# EAGLE design Girlfriend Tracker V0.1 (EAGLE 8.5.0)
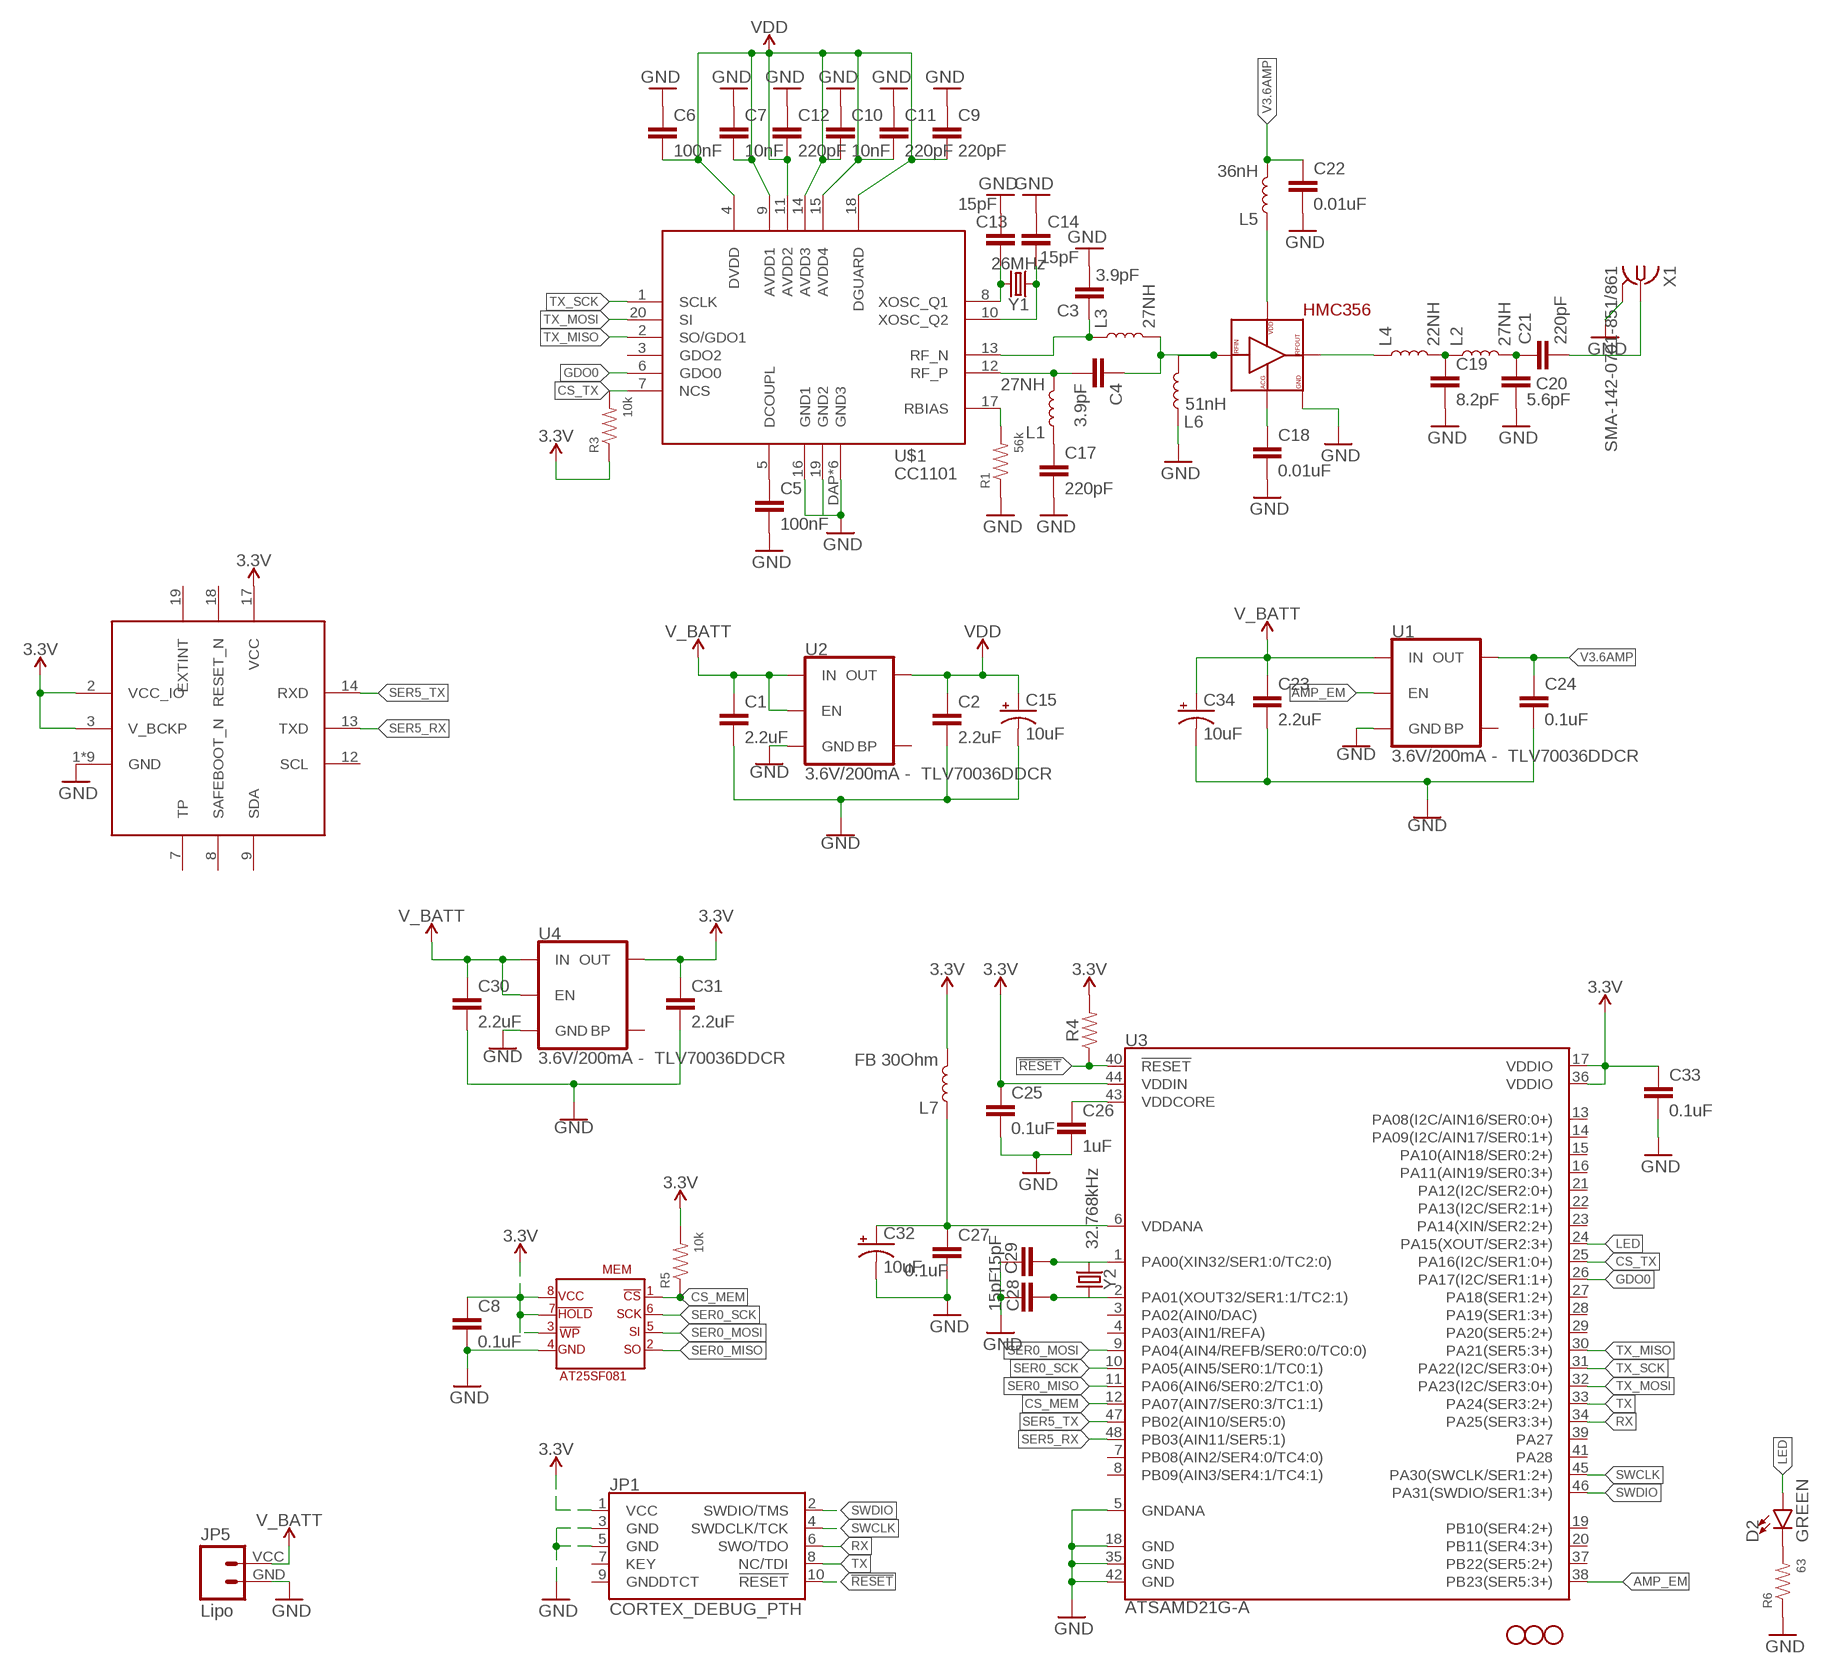
[diagram p0: schematic, sheet 1]

## Parts
C1  2.2uF  2.2UF-0603-10V-20%  [0603]
C2  2.2uF  2.2UF-0603-10V-20%  [0603]
C3  3.9pF  0.1UF-0402-16V-10%  [0402]
C4  3.9pF  0.1UF-0402-16V-10%  [0402]
C5  100nF  0.1UF-0402-16V-10%  [0402]
C6  100nF  0.1UF-0402-16V-10%  [0402]
C7  10nF  0.1UF-0402-16V-10%  [0402]
C8  0.1uF  0.1UF-0402-16V-10%  [0402]
C9  220pF  0.1UF-0402-16V-10%  [0402]
C10  10nF  0.1UF-0402-16V-10%  [0402]
C11  220pF  0.1UF-0402-16V-10%  [0402]
C12  220pF  0.1UF-0402-16V-10%  [0402]
C13  15pF  0.1UF-0402-16V-10%  [0402]
C14  15pF  0.1UF-0402-16V-10%  [0402]
C15  10uF  CAP_POL1206  [EIA3216]
C17  220pF  0.1UF-0402-16V-10%  [0402]
C18  0.01uF  0.1UF-0402-16V-10%  [0402]
C19  8.2pF  0.1UF-0402-16V-10%  [0402]
C20  5.6pF  0.1UF-0402-16V-10%  [0402]
C21  220pF  0.1UF-0402-16V-10%  [0402]
C22  0.01uF  0.1UF-0402-16V-10%  [0402]
C23  2.2uF  2.2UF-0603-10V-20%  [0603]
C24  0.1uF  2.2UF-0603-10V-20%  [0603]
C25  0.1uF  0.1UF-0402-16V-10%  [0402]
C26  1uF  0.1UF-0402-16V-10%  [0402]
C27  0.1uF  0.1UF-0402-16V-10%  [0402]
C28  15pF  15PF-0402-50V-5%  [0402]
C29  15pF  15PF-0402-50V-5%  [0402]
C30  2.2uF  2.2UF-0603-10V-20%  [0603]
C31  2.2uF  2.2UF-0603-10V-20%  [0603]
C32  10uF  CAP_POL1206  [EIA3216]
C33  0.1uF  0.1UF-0402-16V-10%  [0402]
C34  10uF  CAP_POL1206  [EIA3216]
D2  GREEN  LED-GREEN1206  [LED-1206]
H1  STAND-OFFTIGHT  [STAND-OFF-TIGHT]
H2  STAND-OFFTIGHT  [STAND-OFF-TIGHT]
H3  STAND-OFFTIGHT  [STAND-OFF-TIGHT]
IC1  SAM-M8Q  [SAM-M8Q]
JP1  CORTEX_DEBUG_PTH  [2X5-PTH-1.27MM]
JP5  Lipo  M024UCON-15767  [JST-2-SMD-VERT]
L1  27NH  INDUCTOR-0402-3.9NH  [0402]
L2  27NH  INDUCTOR-0402-3.9NH  [0402]
L3  27NH  INDUCTOR-0402-3.9NH  [0402]
L4  22NH  INDUCTOR-0402-3.9NH  [0402]
L5  36nH  INDUCTOR-0402-3.9NH  [0402]
L6  51nH  INDUCTOR-0402-3.9NH  [0402]
L7  FB 30Ohm  INDUCTOR-0603-33NH  [0603]
MEM  AT25SF081  [AT25SF081]
R1  56k  RESISTOR0402  [0402]
R3  10k  RESISTOR0402  [0402]
R4  RESISTOR0402  [0402]
R5  10k  RESISTOR0402  [0402]
R6  63  RESISTOR0402  [0402]
U1  3.6V/200mA - TLV70036DDCR  V_REG_MIC52053.3V  [SOT23-5]
U2  3.6V/200mA - TLV70036DDCR  V_REG_MIC52053.3V  [SOT23-5]
U3  ATSAMD21G-A  [TQFP-48]
U4  3.6V/200mA - TLV70036DDCR  V_REG_MIC52053.3V  [SOT23-5]
U$1  CC1101  [CC1101]
U$3  HMC356  [QFN16_HMC356]
X1  SMA-142-0701-851/861  [J502-ND-142-0701-851/861]
Y1  26MHz  CRYSTALSMD-3.2X2.5  [CRYSTAL-SMD-3.2X2.5MM]
Y2  32.768kHz  CRYSTAL-32.768KHZSMD-3.2X1.5  [CRYSTAL-SMD-3.2X1.5MM]

## Nets
3.3V: C8.1 C25.1 C31.1 C33.1 IC1.2(VCC_IO) IC1.3(V_BCKP) IC1.17(VCC) JP1.1(VCC) L7.2 MEM.!HOLD MEM.!WP MEM.VCC R3.1 R4.2 R5.2 U3.17(VDDIO) U3.36(VDDIO) U3.44(VDDIN) U4.5(OUT)
!RESET: JP1.10(!RESET) R4.1 U3.40(!RESET!)
AMP_EM: U1.3(EN) U3.38(PB23(SER5:3+))
CS_MEM: MEM.!CS R5.1 U3.12(PA07(AIN7/SER0:3/TC1:1))
CS_TX: R3.2 U3.25(PA16(I2C/SER1:0+)) U$1.7(NCS)
GDO0: U3.26(PA17(I2C/SER1:1+)) U$1.6(GDO0)
GND: C1.2 C2.2 C3.2 C5.2 C6.1 C7.1 C8.2 C9.1 C10.1 C11.1 C12.1 C13.1 C14.2 C15.C(-) C17.2 C18.2 C19.2 C20.2 C22.2 C23.2 C24.2 C25.2 C26.2 C27.2 C28.1 C29.1 C30.2 C31.2 C32.C(-) C33.2 C34.C(-) IC1.1(GND) IC1.4(GND) IC1.5(GND) IC1.6(GND) IC1.10(GND) IC1.11(GND) IC1.15(GND) IC1.16(GND) IC1.20(GND) JP1.3(GND) JP1.5(GND) JP5.GND L6.1 MEM.GND R1.1 R6.1 U1.2(GND) U2.2(GND) U3.5(GNDANA) U3.18(GND) U3.35(GND) U3.42(GND) U4.2(GND) U$1.16(GND1) U$1.19(GND2) U$1.DAP(GND3) U$1.P$1(GND3) U$1.P$2(GND3) U$1.P$3(GND3) U$1.P$4(GND3) U$1.P$5(GND3) U$3.P$2 U$3.P$4 U$3.P$6 U$3.P$16 U$3.P$17 U$3.P$17_1 U$3.P$17_2 U$3.P$17_3 U$3.P$17_4 X1.G@1 X1.G@2 X1.G@3 X1.G@4
LED: D2.A U3.24(PA15(XOUT/SER2:3+))
N$1: C17.1 L1.1
N$3: C19.1 L2.1 L4.2
N$4: C13.2 U$1.8(XOSC_Q1) Y1.3
N$5: C20.1 C21.1 L2.2
N$6: C5.1 U$1.5(DCOUPL)
N$7: R1.2 U$1.17(RBIAS)
N$8: C18.1 U$3.P$7
N$9: C21.2 X1.1
N$10: L5.1 U$3.P$15
N$11: C4.1 L3.2 L6.2 U$3.P$3
N$12: C26.1 U3.43(VDDCORE)
N$13: C27.1 C32.A(+) L7.1 U3.6(VDDANA)
N$14: C29.2 U3.1(PA00(XIN32/SER1:0/TC2:0)) Y2.P$2
N$15: C28.2 U3.2(PA01(XOUT32/SER1:1/TC2:1)) Y2.P$1
N$16: L4.1 U$3.P$11
N$20: C14.1 U$1.10(XOSC_Q2) Y1.1
N$29: D2.C R6.2
RF_N: C3.1 L3.1 U$1.13(RF_N)
RF_P: C4.2 L1.2 U$1.12(RF_P)
RX: JP1.6(SWO/TDO) U3.34(PA25(SER3:3+))
SER0_MISO: MEM.SO U3.11(PA06(AIN6/SER0:2/TC1:0))
SER0_MOSI: MEM.SI U3.9(PA04(AIN4/REFB/SER0:0/TC0:0))
SER0_SCK: MEM.SCK U3.10(PA05(AIN5/SER0:1/TC0:1))
SER5_RX: IC1.13(TXD) U3.48(PB03(AIN11/SER5:1))
SER5_TX: IC1.14(RXD) U3.47(PB02(AIN10/SER5:0))
SWCLK: JP1.4(SWDCLK/TCK) U3.45(PA30(SWCLK/SER1:2+))
SWDIO: JP1.2(SWDIO/TMS) U3.46(PA31(SWDIO/SER1:3+))
TX: JP1.8(NC/TDI) U3.33(PA24(SER3:2+))
TX_MISO: U3.30(PA21(SER5:3+)) U$1.2(SO/GDO1)
TX_MOSI: U3.32(PA23(I2C/SER3:0+)) U$1.20(SI)
TX_SCK: U3.31(PA22(I2C/SER3:0+)) U$1.1(SCLK)
V3.6AMP: C22.1 C24.1 L5.2 U1.5(OUT)
V_BATT: C1.1 C23.1 C30.1 C34.A(+) JP5.VCC U1.1(IN) U2.1(IN) U2.3(EN) U4.1(IN) U4.3(EN)
VDD: C2.1 C6.2 C7.2 C9.2 C10.2 C11.2 C12.2 C15.A(+) U2.5(OUT) U$1.4(DVDD) U$1.9(AVDD1) U$1.11(AVDD2) U$1.14(AVDD3) U$1.15(AVDD4) U$1.18(DGUARD)
Unconnected: IC1.7(TP) IC1.8(SAFEBOOT_N) IC1.9(SDA) IC1.12(SCL) IC1.18(RESET_N) IC1.19(EXTINT) JP1.7(KEY) JP1.9(GNDDTCT) U1.4(BP) U2.4(BP) U3.3(PA02(AIN0/DAC)) U3.4(PA03(AIN1/REFA)) U3.7(PB08(AIN2/SER4:0/TC4:0)) U3.8(PB09(AIN3/SER4:1/TC4:1)) U3.13(PA08(I2C/AIN16/SER0:0+)) U3.14(PA09(I2C/AIN17/SER0:1+)) U3.15(PA10(AIN18/SER0:2+)) U3.16(PA11(AIN19/SER0:3+)) U3.19(PB10(SER4:2+)) U3.20(PB11(SER4:3+)) U3.21(PA12(I2C/SER2:0+)) U3.22(PA13(I2C/SER2:1+)) U3.23(PA14(XIN/SER2:2+)) U3.27(PA18(SER1:2+)) U3.28(PA19(SER1:3+)) U3.29(PA20(SER5:2+)) U3.37(PB22(SER5:2+)) U3.39(PA27) U3.41(PA28) U4.4(BP) U$1.3(GDO2)

## Library data of the parts
C1 C2 C23 C30 C31 = SparkFun-Capacitors:2.2UF: 2.2µF ceramic capacitors A capacitor is a passive two-terminal electrical component used to store electrical energy temporarily in an electric field.; PROD_ID: CAP-07888
C3-C7 C9-C14 C17-C22 C26 = SparkFun-Capacitors:0.1UF: 0.1µF ceramic capacitors A capacitor is a passive two-terminal electrical component used to store electrical energy temporarily in an electric field.; PROD_ID: CAP-12416; VALUE: 0.1uF
C8 C25 C27 C33 = SparkFun-Capacitors:0.1UF: 0.1µF ceramic capacitors A capacitor is a passive two-terminal electrical component used to store electrical energy temporarily in an electric field.; PROD_ID: CAP-12416
C15 C32 C34 = SparkFun:CAP_POL: Capacitor Polarized These are standard SMD and PTH capacitors. Normally 10uF, 47uF, and 100uF in electrolytic and tantalum varieties. Always verify the external diameter of the through hole cap, it varies with capacity, voltage, and manufacturer. The EIA devices should be standard.
C24 = SparkFun-Capacitors:2.2UF: 2.2µF ceramic capacitors A capacitor is a passive two-terminal electrical component used to store electrical energy temporarily in an electric field.; PROD_ID: CAP-07888; VALUE: 2.2uF
C28 C29 = SparkFun-Capacitors:15PF: 15pF ceramic capacitors A capacitor is a passive two-terminal electrical component used to store electrical energy temporarily in an electric field.; PROD_ID: CAP-13063
D2 = SparkFun-LED:LED-GREEN: Green SMD LED Used in manufacturing of various products at SparkFun Packages: 0603 - SMD 0603 package [Product Link] <http://www.futureelectronics.com/en/technologies/semiconductors/optoelectronics/leds/Pages/9894312-LTST-C190GKT.aspx?CrossPart=HSMG-C190&IM=0> LilyPad 1206 - SMD1206 LilyPad package [Product Link] <http://www.futureelectronics.com/en/Technologies/Product.aspx?ProductID=IN150NGHARVATEKCORPORATION2049943&IM=0> 1206 - SMD1206 package [Product Link] <http://www.futureelectronics.com/en/technologies/semiconductors/optoelectronics/leds/Pages/8315665-LTST-C150KGKT.aspx?IM=0> 1206 Bottom Mount -SMD 1206 Bottom Mount [Product Link] <http://www.digikey.com/product-detail/en/lite-on-inc/LTST-C230KGKT/160-1456-1-ND/386854> SparkFun Products: Pro Mini 328 -5V <https://www.sparkfun.com/products/821> RedBoard <https://www.sparkfun.com/products/12757> MP3 Trigger <https://www.sparkfun.com/products/13720> Makey Makey <https://www.sparkfun.com/products/11076>; PROD_ID: DIO-00862
H1-H3 = SparkFun-Hardware:STAND-OFF: Stand Off Drill holes for mechanically mounting via screws, standoffs, etc. Note: Use the keepout ring to avoid running the screw head into surrounding components. Variant Overviews STAND-OFF - Mechanical footprint for a #4 phillips button head screw. STAND-OFF-TIGHT - Mechanical footprint for a #4 phillips button head screw, Example SparkFun Products Screw - Phillips Head (1/4", 4-40, 10 pack) <https://www.sparkfun.com/products/10453> (PRT-10453) Screw - Phillips Head (1/2", 4-40, 10 pack) <https://www.sparkfun.com/products/10452> (PRT-10452) Screw - Phillips Head (3/4", 4-40, 10 pack) <https://www.sparkfun.com/products/10451> (PRT-10451) Screw - Phillips Head (1", 4-40, 10 pack) <https://www.sparkfun.com/products/10450> (PRT-10450)
IC1 = ubloxLib:SAM-M8Q: u-blox SAM GNSS antenna module
JP1 = SparkFun-Connectors:CORTEX_DEBUG: Cortex Debug Connector - 10 pin Supports JTAG debug, Serial Wire debug, and Serial Wire Viewer. PTH and SMD connector options available. General Connector Information <http://infocenter.arm.com/help/topic/com.arm.doc.faqs/attached/13634/cortex_debug_connectors.pdf> Products: PTH Connector <http://www.digikey.com/product-detail/en/cnc-tech/3220-10-0100-00/1175-1627-ND/3883661> -via Digi-Key SparkFun PSoc <https://www.sparkfun.com/products/13229> SparkFun T <https://www.sparkfun.com/products/13810>
JP5 = SparkFun-Connectors:M02: Standard 2-pin 0.1" header. Use with - straight break away headers ( PRT-00116) - right angle break away headers (PRT-00553) - swiss pins (PRT-00743) - machine pins (PRT-00117) - female headers (PRT-00115) Molex polarized connector foot print use with: PRT-08233 with associated crimp pins and housings. 2.54_SCREWTERM for use with PRT-10571. 3.5mm Screw Terminal footprints for PRT-08084 5mm Screw Terminal footprints for use with PRT-08432
L1-L6 = SparkFun-Coils:INDUCTOR: Inductors Resist changes in electrical current. Basically a coil of wire. SparkFun Products: SparkFun Load Cell Amplifier - HX711 <https://www.sparkfun.com/products/13879> IOIO-OTG - V2.2 <https://www.sparkfun.com/products/13613>; PROD_ID: NDUC-13457; VALUE: 3.9NH
L7 = SparkFun-Coils:INDUCTOR: Inductors Resist changes in electrical current. Basically a coil of wire. SparkFun Products: SparkFun Load Cell Amplifier - HX711 <https://www.sparkfun.com/products/13879> IOIO-OTG - V2.2 <https://www.sparkfun.com/products/13613>; PROD_ID: NDUC-07874; VALUE: 33nH/±5%/500mA
MEM = SaL-lib:AT25SF081: AT25SF081 - 8M memory smd
R1 R3-R6 = SparkFun-Resistors:RESISTOR: Generic Resistor Package
U1 U2 U4 = SparkFun-IC-Power:V_REG_MIC5205: V_REG MIC5205 Standard 3.3V, 5V, and Adjustable 150mA LDO voltage regulator in SOT-23 layout. Micrel part MIC5205. BP (by-pass) pin is used to lower output noise with 470pF cap, may be left open. On the adjustable version BP is used to set output.; PROD_ID: VREG-00822; VALUE: 3.3V/150mA
U3 = SparkFun-IC-Microcontroller:ATSAMD21G: Atmel SAMD21G SMART ARM-Based Microcontroller The Atmel ® | SMART ™ SAM D21 is a series of low-power microcontrollers using the 32-bit ARM ® Cortex ® -M0+ processor, and ranging from 32- to 64-pins with up to 256KB Flash and 32KB of SRAM. The SAM D21 devices operate at a maximum frequency of 48MHz and reach 2.46 CoreMark/MHz. They are designed for simple and intuitive migration with identical peripheral modules, hex compatible code, identical linear address map and pin compatible migration paths between all devices in the product series. All devices include intelligent and flexible peripherals, Atmel Event System for inter-peripheral signaling, and support for capacitive touch button, slider and wheel user interfaces. Datasheet <https://cdn.sparkfun.com/datasheets/Dev/Arduino/Boards/Atmel-42181-SAM-D21_Datasheet.pdf> SparkFun Products SparkFun SAMD21 Mini Breakout <https://www.sparkfun.com/products/13664> (DEV-13664) SparkFun SAMD21 Dev Breakout <https://www.sparkfun.com/products/13672> (DEV-13672); PROD_ID: IC-13064
U$1 = SaL-lib1:CC1101
U$3 = SaL-lib1:HMC356
X1 = con-coax:SMA-: SMA 50 Ohm End Launch Jack Receptacle - Round Contact Johnson Components Source: www.johnsoncomponents.com .. J502-ND.pdf; MF: JOHNSON COMPONENTS; MPN: 142-0701-851; OC_FARNELL: 1019325; OC_NEWARK: 99F6798
Y1 = SparkFun-Clocks:CRYSTAL: Crystals (Generic) These are passive quartz crystals, which can be used as a clock source for a microcontroller. Crystal's are two-terminal devices. They require external "load" capacitors to generate an oscillating signal.
Y2 = SparkFun-Clocks:CRYSTAL-32.768KHZ: 32.768kHz Crystal Frequency: 32.768kHz Frequency Stability: ±20ppm Load Capacitance: 12.5pF (PTH-2X6 & SMD-3.2X1.5), 6pF (SMD-2X6) SparkFun Products: SparkFun BigTime Watch Kit <https://www.sparkfun.com/products/11734> SparkFun nRF52832 Breakout <https://www.sparkfun.com/products/13990> SparkFun Real Time Clock Module <https://www.sparkfun.com/products/12708>; PROD_ID: XTAL-13062

## Net classes
1 power: width 0.254 mm

## Board
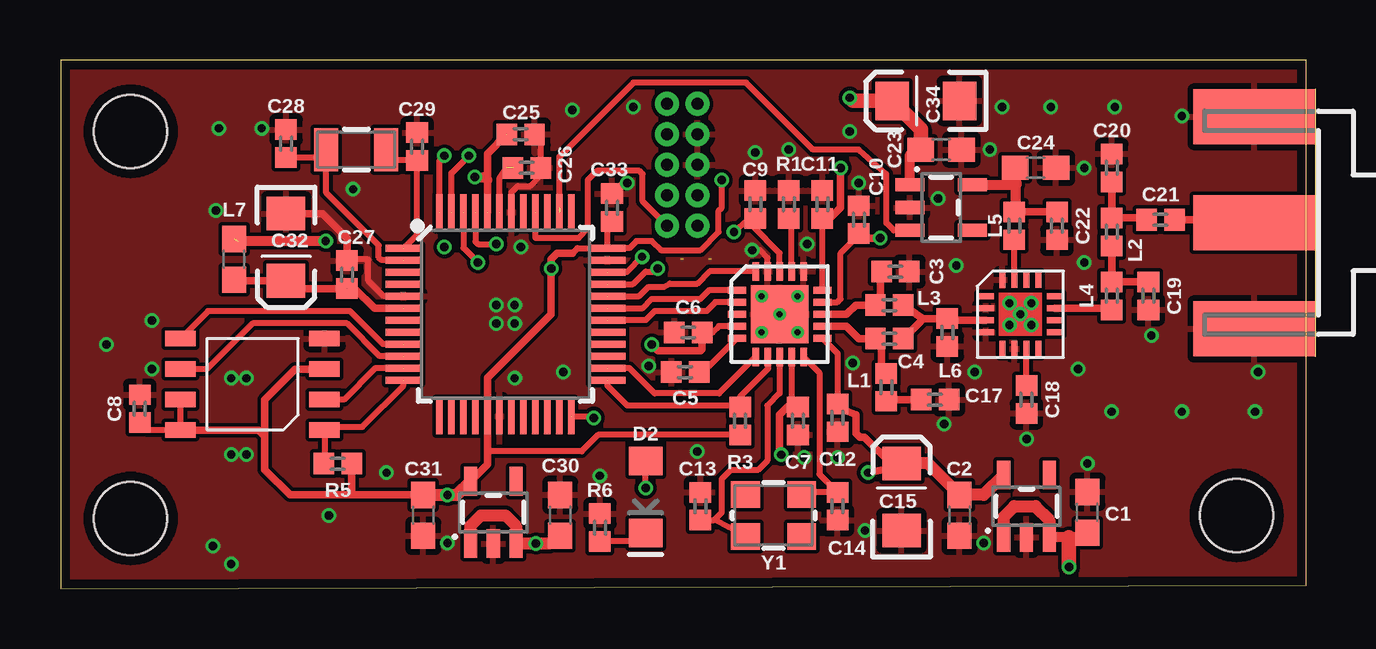
[diagram p1: board, top side]
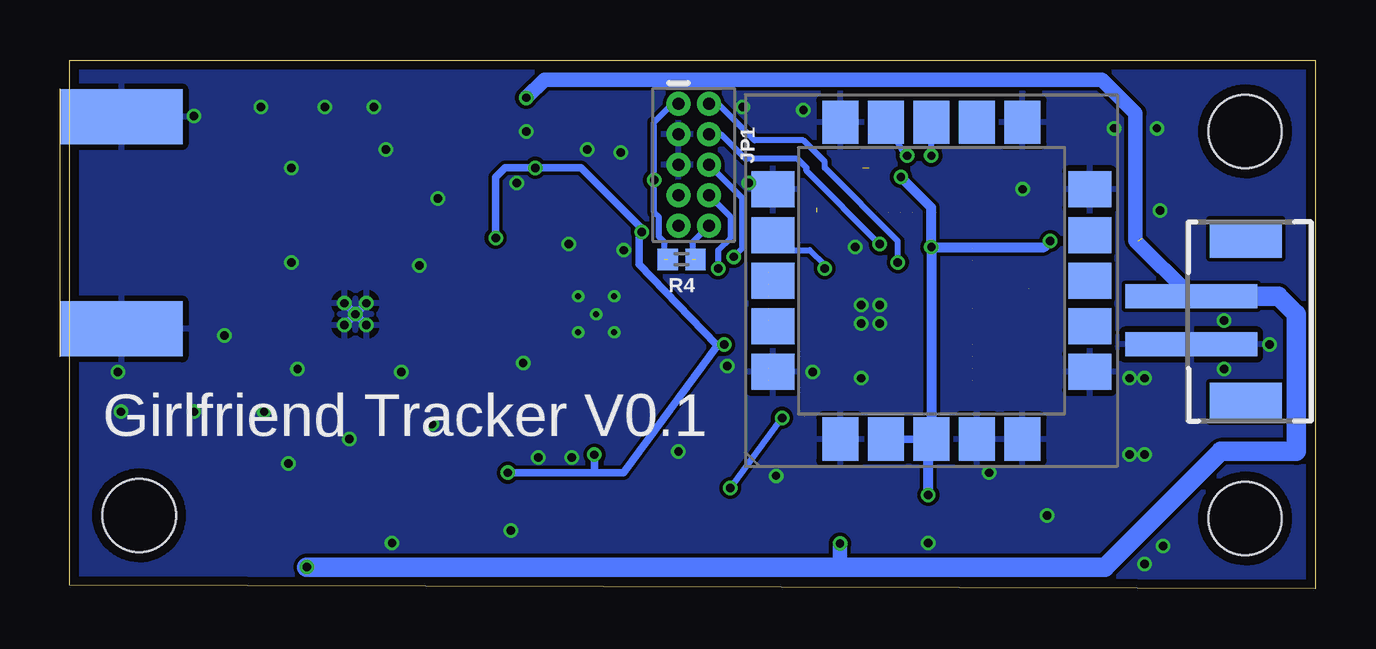
[diagram p2: board, bottom side, seen from below]

Size 51.92 x 22.02 mm. Coordinates in mm from the lower left corner, seen from the top.
Outline: 0,0 51.92,0.13 51.92,22.02 0,22.02 0,0
Copper layers (1*16): Top 0.035559375mm / dielectric 1.6mm / Bottom 0.035559375mm
Design rules "oshpark-2layer-tented *": minimum track width 6mil, minimum drill 10mil, track to track 6mil, track to pad 6mil, pad to pad 6mil, via to via 6mil, smd to smd 6mil, copper to edge 15mil, drill to drill 6mil, minimum pad ring 5mil, minimum via ring 5mil, stop-mask expansion 0mil, vias tented up to drill 20mil, thermal gap 10mil

### Footprints (pad centres in the part's own frame; a part is rotated, then mirrored left to right if it is on the bottom)
0603 = smd 1.1 x 1: 1 -0.85,0; 2 0.85,0
0402 = smd 0.85 x 0.9: 1 -0.58,0; 2 0.58,0
EIA3216 = smd 1.4 x 1.6: A 1.4,0; C -1.4,0
LED-1206 = smd 1.2 x 1.4: A -1.5,0; C 1.5,0
STAND-OFF-TIGHT = hole 3.048: 0,0
SAM-M8Q = smd 1.8 x 1.5: 1 -6.6,3.8; 2 -6.6,1.9; 3 -6.6,0; 4 -6.6,-1.9; 5 -6.6,-3.8; 11 6.6,-3.8; 12 6.6,-1.9; 13 6.6,0; 14 6.6,1.9; 15 6.6,3.8 | smd 1.5 x 1.8: 6 -3.8,-6.6; 7 -1.9,-6.6; 8 0,-6.6; 9 1.9,-6.6; 10 3.8,-6.6; 16 3.8,6.6; 17 1.9,6.6; 18 0,6.6; 19 -1.9,6.6; 20 -3.8,6.6
2X5-PTH-1.27MM = drill 0.508 pad 1: 1 -2.54,-0.635; 2 -2.54,0.635; 3 -1.27,-0.635; 4 -1.27,0.635; 5 0,-0.635; 6 0,0.635; 7 1.27,-0.635; 8 1.27,0.635; 9 2.54,-0.635; 10 2.54,0.635
JST-2-SMD-VERT = smd 1 x 5.5: GND 1,-2; VCC -1,-2 | smd 1.6 x 3: P$1 -3.4,0.27; P$2 3.4,0.27
AT25SF081 = smd 1.27 x 0.635: !CS -3,2.54; !HOLD 3,1.27; !WP -3,0; GND -3,-1.27; SCK 3,0; SI 3,-1.27; SO -3,1.27; VCC 3,2.54
SOT23-5 = smd 0.55 x 1.2: 1 -0.95,-1.3; 2 0,-1.3; 3 0.95,-1.3; 4 0.95,1.3; 5 -0.95,1.3
TQFP-48 = smd 1.5 x 0.28: 1 -4.25,2.75; 2 -4.25,2.25; 3 -4.25,1.75; 4 -4.25,1.25; 5 -4.25,0.75; 6 -4.25,0.25; 7 -4.25,-0.25; 8 -4.25,-0.75; 9 -4.25,-1.25; 10 -4.25,-1.75; 11 -4.25,-2.25; 12 -4.25,-2.75; 25 4.25,-2.75; 26 4.25,-2.25; 27 4.25,-1.75; 28 4.25,-1.25; 29 4.25,-0.75; 30 4.25,-0.25; 31 4.25,0.25; 32 4.25,0.75; 33 4.25,1.25; 34 4.25,1.75; 35 4.25,2.25; 36 4.25,2.75 | smd 0.28 x 1.5: 13 -2.75,-4.25; 14 -2.25,-4.25; 15 -1.75,-4.25; 16 -1.25,-4.25; 17 -0.75,-4.25; 18 -0.25,-4.25; 19 0.25,-4.25; 20 0.75,-4.25; 21 1.25,-4.25; 22 1.75,-4.25; 23 2.25,-4.25; 24 2.75,-4.25; 37 2.75,4.25; 38 2.25,4.25; 39 1.75,4.25; 40 1.25,4.25; 41 0.75,4.25; 42 0.25,4.25; 43 -0.25,4.25; 44 -0.75,4.25; 45 -1.25,4.25; 46 -1.75,4.25; 47 -2.25,4.25; 48 -2.75,4.25
CC1101 = smd 0.76 x 0.28: 1 -1.78,1; 2 -1.78,0.5; 3 -1.78,0; 4 -1.78,-0.5; 5 -1.78,-1; 11 1.78,-1; 12 1.78,-0.5; 13 1.78,0; 14 1.78,0.5; 15 1.78,1 | smd 0.28 x 0.76: 6 -1,-1.78; 7 -0.5,-1.78; 8 0,-1.78; 9 0.5,-1.78; 10 1,-1.78; 16 1,1.78; 17 0.5,1.78; 18 0,1.78; 19 -0.5,1.78; 20 -1,1.78 | smd 2.4 x 2.4: DAP 0,0 | drill 0.254 pad 0.457: P$1 -0.75,0.75; P$2 0.75,0.75; P$3 0.75,-0.75; P$4 -0.75,-0.75; P$5 0,0
QFN16_HMC356 = smd 0.66 x 0.254: P$1 -1.435,0.75; P$2 -1.435,0.25; P$3 -1.435,-0.25; P$4 -1.435,-0.75; P$9 1.435,-0.75; P$10 1.435,-0.25; P$11 1.435,0.25; P$12 1.435,0.75 | smd 0.254 x 0.66: P$5 -0.75,-1.435; P$6 -0.25,-1.435; P$7 0.25,-1.435; P$8 0.75,-1.435; P$13 0.75,1.435; P$14 0.25,1.435; P$15 -0.25,1.435; P$16 -0.75,1.435 | drill 0.35 pad 0.406: P$17 0,0; P$17_1 0.457,0.457; P$17_2 -0.457,0.457; P$17_3 -0.457,-0.457; P$17_4 0.457,-0.457
J502-ND-142-0701-851/861 = smd 5.08 x 2.286: 1 2.565,0; G@1 2.565,4.42; G@2 2.565,-4.42 | smd 5.08 x 2.286 bottom: G@3 2.565,4.42; G@4 2.565,-4.42
CRYSTAL-SMD-3.2X2.5MM = smd 1.2 x 1.1: 1 -1.175,-0.875; 2 1.175,-0.875; 3 1.175,0.875; 4 -1.175,0.875
CRYSTAL-SMD-3.2X1.5MM = smd 1 x 1.8: P$1 -1.25,0; P$2 1.25,0

### Placement (x,y rotation side)
C1  42.8,3.17 90 top
C2  37.47,3.05 270 top
C3  34.8,13.21 0 top
C4  34.54,10.41 180 top
C5  26.04,9.02 180 top
C6  26.16,10.67 0 top
C7  30.73,6.99 90 top
C8  3.3,7.49 90 top
C9  28.96,16 270 top
C10  33.27,15.37 270 top
C11  31.75,16 270 top
C12  32.38,7.11 90 top
C13  26.67,3.43 270 top
C14  32.38,3.43 270 top
C15  35.05,3.81 90 top
C17  36.45,7.87 0 top
C18  40.26,7.87 270 top
C19  45.34,12.19 270 top
C20  43.81,17.53 90 top
C21  45.85,15.37 0 top
C22  41.53,15.11 270 top
C23  36.7,18.29 0 top
C24  40.64,17.53 0 top
C25  19.18,18.92 0 top
C26  19.43,17.53 0 top
C27  11.94,13.08 90 top
C28  9.4,18.54 270 top
C29  14.86,18.41 270 top
C30  20.83,3.05 90 top
C31  15.11,3.05 270 top
C32  9.4,14.22 270 top
C33  22.99,15.88 90 top
C34  36.07,20.32 180 top
D2  24.38,3.81 270 top
H1  49.02,3.05 0 top
H2  2.92,19.05 0 top
H3  2.92,2.92 0 top
IC1  16,12.83 90 bottom
JP1  25.91,17.65 270 bottom
JP5  3.17,11.18 270 bottom
L1  34.42,8.38 90 top
L2  43.81,14.86 90 top
L3  34.54,11.81 0 top
L4  43.81,12.19 90 top
L5  39.75,15.11 90 top
L6  36.96,10.67 90 top
L7  7.24,13.72 90 top
MEM  8,9.14 180 top
R1  30.35,16 270 top
R3  28.32,6.99 90 top
R4  26.42,13.72 180 bottom
R5  11.56,5.21 0 top
R6  22.48,2.54 270 top
U1  36.7,15.88 270 top
U2  40.26,3.43 0 top
U3  18.54,11.43 0 top
U4  18.03,3.17 0 top
U$1  29.97,11.43 0 top
U$3  40.01,11.43 0 top
X1  52.32,15.24 180 top
Y1  29.72,3.05 180 top
Y2  12.32,18.29 0 top

### Tracks (layer width: path | path; a pad name or v marks a point on that pad's centre or on a via)
3.3V  (via drill 0.35)  (4 unrouted)
  Top 0.254: MEM.!HOLD MEM.VCC 3.61,6.6 C8.1 | R3.1 22.41,6.41 21.72,5.71 17.79,5.71 | v27.56,17.02 27.56,15.88 27.43,15.75 27.43,14.86 26.67,14.1 25.02,14.1 24.64,14.48 24,14.48 23.71,14.18 U3.36 | 17.79,5.71 | 21.34,13.97 21.55,14.18 U3.36 | U3.36 22.79,15.1 C33.1
  Top 0.305: MEM.!WP 9.78,9.14 8.51,7.87 8.51,6.35 | U4.5 17.79,5.18 17.79,5.71 U3.17 17.79,8.78 20.45,11.43 v20.45,13.34 20.45,13.72 20.7,13.97 21.34,13.97 | U3.44 17.79,17.02 17.79,18.12 C25.1 | C31.1 12.19,3.9 | 12.19,3.9 9.56,3.9 8.51,4.95 8.51,6.35 | R5.2 12.14,3.95 12.19,3.9 | MEM.VCC 8.26,6.6 8.51,6.35
  Top 0.406: v11.05,14.48 7.4,14.48 | v17.27,17.14 17.66,17.14 17.79,17.02
  Top 0.508: C31.1 v16.13,3.9 16.51,3.9 U4.5
  Bottom 0.254: 27.12,13.72 27.12,14.42 27.36,14.66 27.36,15.49 27.56,15.69 v27.56,17.02 27.56,19.43 26.8,20.19 JP1.1 | 22.08,14.73 IC1.17 21.97,14.1 21.08,14.1 20.45,13.46 v20.45,13.34
  Bottom 0.305: IC1.2 IC1.3 16.13,6.1
  Bottom 0.406: v16,14.22 11.3,14.22 v11.05,14.48 | v16,14.22 16,15.88 v17.27,17.14 | v16.13,3.9 16.13,5.71 | 16.13,5.71 16.13,6.1 | 16.13,5.71 16,5.84 v16,14.22
!RESET  (2 unrouted)
  Top 0.254: U3.40 19.79,14.62 19.81,14.61 21.59,14.61 21.97,14.99 21.97,17.02 22.35,17.4 24.13,17.4 24.26,17.27 24.26,16.13 JP1.10
  Bottom 0.254: JP1.10 25.96,14.42 25.96,13.72
AMP_EM  (1 unrouted)
  Top 0.254: U1.3 34.73,14.93 34.42,15.24 34.42,17.27 33.27,18.29 31.37,18.29 28.58,21.08 23.88,21.08 20.79,18 20.79,15.88
CS_MEM  (1 unrouted)
  Top 0.254: U3.12 14.29,8.45 12.57,6.73 11.13,6.73 MEM.!CS 11,5.23 R5.1
CS_TX  (1 unrouted)
  Top 0.254: U$1.7 29.49,9.54 29.49,9.16 28.32,7.99 R3.2 28.01,7.62 23.62,7.62 22.79,8.45 U3.25
GDO0  (1 unrouted)
  Top 0.254: U$1.6 27.45,8.13 24.77,8.13 23.71,9.18 U3.26
GND  (via drill 0.35)
  Top 0.254: U3.5 13.47,12.18 12.83,12.83 12.83,13.72 11.99,13.72 C27.2 | U$1.19 29.47,13.77 29.14,14.1 v28.83,14.1 | U3.42 18.79,16.51 19.05,16.76 19.56,16.76 20.01,17.22 20.01,18.67 C25.2 | C33.2 23.42,16.89 v23.62,16.89
  Top 0.305: C27.2 11.94,14.61 10.92,15.62 C32.C
  Bottom 0.305: U$3.P$17_2 U$3.P$17 | U$3.P$17 U$3.P$17_4 | U$3.P$17_1 U$3.P$17 | U$3.P$17 U$3.P$17_3
  other vias: 3.81,11.18 1.91,10.16 7.75,8.76 7.11,8.76 7.75,5.59 7.11,5.59 18.16,11.81 18.92,11.81 18.16,11.05 18.92,11.05 22.48,4.7 16.13,1.91 36.58,16.26 33.27,16.89 30.35,18.29 28.96,18.16 38.73,18.29 42.67,17.53 42.67,13.59 37.34,13.46 38.1,9.02 42.42,9.14 40.26,6.22 36.83,6.86 42.8,5.21 49.91,9.02 46.74,19.68 45.47,10.54 38.48,1.91 33.53,2.41 11.18,3.05 13.59,4.83 12.19,16.64 8.38,19.18 41.27,20.07 43.94,20.07 43.81,7.37 46.74,7.37 49.78,7.37 31.12,14.35 21.34,19.94 23.88,20.07 19.18,14.22 24.51,9.27 6.48,15.75 6.35,1.78 6.6,19.18 7.11,1.02 30.99,5.46 32.38,5.46 18.92,8.76 26.54,5.71 20.96,9.02 32.89,19.05 39.24,20.07 33.02,9.4 3.81,9.14
  pour Top: -0.51,0 52.83,0 52.83,22.86 -0.51,22.86
  pour Bottom: -0.51,-0.64 -0.51,23.5 52.83,23.5 52.83,-0.64
LED  (via drill 0.35)  (1 unrouted)
  Top 0.254: U3.24 22.28,7.18 v22.23,7.11 | v24.38,4.19 D2.A
  Bottom 0.254: v22.23,7.11 v24.38,4.19
N$1
  Top 0.254: L1.1 34.34,7.87
  Top 0.305: 34.34,7.87 C17.1
N$3
  Top 0.305: L2.1 L4.2 C19.1
N$4
  Top 0.254: U$1.8 29.97,8.13 29.46,7.62 29.46,5.33 29.08,4.95 27.94,4.95 27.56,4.57 27.56,3.17 27.23,2.85 | C13.2 27.23,2.85 | 27.23,2.85 27.3,2.85 27.85,2.55 Y1.3
N$5
  Top 0.254: 45.32,15.44 C21.1
  Top 0.305: 45.32,15.44 L2.2 C20.1
N$6
  Top 0.254: U$1.5 27.03,9.27 C5.1
N$7
  Top 0.254: U$1.17 30.47,15.3 R1.2
N$8
  Top 0.254: C18.1 U$3.P$7
N$9
  Top 0.254: 49.66,15.37 49.66,15.24 X1.1
  Top 0.305: C21.2 49.66,15.37
N$10
  Top 0.254: U$3.P$15 L5.1
N$11
  Top 0.254: 37.02,11.18 L6.2
  Top 0.305: L3.2 35.94,11.25 | 35.94,11.25 L6.2 | C4.1 35.83,11.12 35.94,11.25 | U$3.P$3 37.02,11.18
N$12  (2 unrouted)
  Top 0.254: U3.43 18.29,17.09 18.6,17.53
N$13  (2 unrouted)
  Top 0.254: U3.6 | C27.1 11.83,12.61
  Top 0.305: U3.6 13.08,11.68 12.26,12.5 C27.1 9.72,12.5 C32.A 7.28,12.82 L7.1
N$14  (1 unrouted)
  Top 0.254: U3.1 14.86,14.75 C29.2 14.02,17.84 Y2.P$2
N$15  (1 unrouted)
  Top 0.254: U3.2 13.37,13.68 13.26,13.79 13.26,14.3 11.07,16.49 Y2.P$1 10.74,17.96 C28.2
N$16
  Top 0.254: 43.87,11.68 L4.1
  Top 0.305: U$3.P$11 43.87,11.68
N$20
  Top 0.254: U$1.10 31.62,9 31.62,4.77 C14.1 30.93,4.01 Y1.1
N$29
  Top 0.254: D2.C 24.03,1.96 R6.2
RF_N
  Top 0.254: C3.1 34.16,13.08 | 34.16,12.14 L3.1
  Top 0.305: U$1.13 32.77,11.43 33.15,11.81 L3.1 | 34.16,13.08 34.16,12.14
RF_P
  Top 0.152: C4.2 34.22,10.16
  Top 0.254: 34.22,9.16 L1.2
  Top 0.305: U$1.12 32.76,10.93 33.27,10.41 C4.2 34.09,10.29 34.16,10.29 | 34.22,10.16 34.22,9.16
RX  (via drill 0.35)  (1 unrouted)
  Top 0.254: U3.34 23.6,13.19 v24.24,13.82
  Bottom 0.254: 24.12,13.82 v24.24,13.82 24.24,13.83 23.88,14.19 23.88,16.26 JP1.6
SER0_MISO  (1 unrouted)
  Top 0.254: U3.11 13.12,9.18 11.81,7.87 MEM.SO
SER0_MOSI  (1 unrouted)
  Top 0.254: U3.9 13.44,10.18 12.06,11.56 6.14,11.56 MEM.SI
SER0_SCK  (1 unrouted)
  Top 0.254: U3.10 13.31,9.68 11.94,11.05 8,11.05 6.1,9.14 MEM.SCK
SER5_RX  (via drill 0.35)  (1 unrouted)
  Top 0.254: U3.48 15.79,17.82 v16,18.03
  Bottom 0.254: v16,18.03 IC1.13
SER5_TX  (via drill 0.35)  (1 unrouted)
  Top 0.254: U3.47 16.29,17.31 v17.02,18.03
  Bottom 0.254: IC1.14 17.14,18.16 v17.02,18.03
SWCLK  (via drill 0.35)  (1 unrouted)
  Top 0.254: U3.45 17.29,14.46 17.4,14.35 v18.16,14.35
  Bottom 0.254: v18.16,14.35 21.21,17.4 21.21,17.53 21.59,17.91 23.75,17.91 24.77,18.92 JP1.4
SWDIO  (via drill 0.35)  (1 unrouted)
  Top 0.254: U3.46 16.79,14.2 v17.4,13.59
  Bottom 0.254: v17.4,13.59 17.4,14.48 20.45,17.53 20.45,17.78 21.34,18.67 23.37,18.67 24.89,20.19 JP1.2
TX  (via drill 0.35)  (1 unrouted)
  Top 0.254: U3.33 23.86,12.68 24.38,13.21 24.77,13.21 v24.89,13.34
  Bottom 0.254: JP1.8 24.38,15.49 24.38,14.61 24.89,14.1 v24.89,13.34
TX_MISO  (1 unrouted)
  Top 0.254: U$1.2 27.3,11.93 26.92,11.56 24.77,11.56 24.39,11.18 U3.30
TX_MOSI  (1 unrouted)
  Top 0.254: U$1.20 27.05,13.21 26.54,12.7 25.4,12.7 25.15,12.57 24.51,12.57 24.12,12.18 U3.32
TX_SCK  (1 unrouted)
  Top 0.254: U3.31 24.26,11.68 24.64,12.06 26.67,12.06 27.05,12.45 28.18,12.45 U$1.1
V3.6AMP
  Top 0.305: C22.1 L5.2
  Top 0.406: U1.5 39.85,16.82 C24.1 39.79,15.73 L5.2
V_BATT  (via drill 0.35)
  Top 0.406: 35.85,18.92 C23.1 35.4,18.09 U1.1 | C1.1 42.6,2.13 42.04,2.13 U2.3
  Top 0.508: U2.1 39.31,2.99 39.75,3.43 40.64,3.43 41.21,2.86 U2.3 | U4.1 17.08,2.61 17.53,3.05 18.54,3.05 18.98,2.61 U4.3 v19.81,1.88 20.38,1.88 C30.1
  Top 0.61: 42.04,2.13 v42.04,0.89 | v32.89,20.45 33.02,20.32 C34.A 35.85,19.14 C23.1
  Bottom 0.61: JP5.VCC 7.49,14.49 7.49,19.81 8.89,21.21 32.13,21.21 v32.89,20.45 | 19.81,0.89 v19.81,1.88
  Bottom 0.813: JP5.VCC 1.53,12.18 0.79,11.43 0.79,5.71 3.94,5.71 8.76,0.89 19.81,0.89 v42.04,0.89
VDD  (via drill 0.35)
  Top 0.254: U$1.14 32.38,11.93 32.51,12.06 32.51,13.97 33.4,14.86 C10.2 | U$1.15 31.75,12.55 C11.2 32.06,15.42 | U$1.4 27.44,10.93 27.18,10.67 C6.2 | U$1.11 32.38,9.8 C12.2 32.69,7.44 | U$1.9 30.47,7.83 C7.2 | U$1.18 29.97,13.97 28.83,15.11 C9.2 28.77,15.49 v28.07,14.86 | 34.92,5.08 C15.A 34.6,5.21
  Top 0.305: C7.2 30.3,7.57 29.97,7.24 29.97,5.65 v30.05,5.58 | 32.06,15.42 32.51,15.88 v32.51,17.53 | C10.2 33.71,14.61 v34.16,14.61 | C6.2 26.74,9.98 26.67,9.91 24.89,9.91 v24.64,10.16 | v33.66,4.83 34.92,5.08 | 34.6,5.21 33.52,6.3 33.33,6.3 33.15,6.48 33.15,7.24 32.69,7.44
  Top 0.508: U2.5 38.48,3.9 C2.1 36.15,5.21 C15.A
  Bottom 0.254: 24.96,10.16 24.89,10.16 | 28.07,14.99 v28.07,14.86 | 29.97,4.83 30.05,4.9
  Bottom 0.305: v33.66,4.83 29.97,4.83 28.83,4.83 24.89,10.16 v24.64,10.16 | v28.07,14.86 28.19,14.61 28.19,13.52 24.96,10.16 | 28.07,14.99 30.61,17.53 v32.51,17.53 33.78,17.53 34.16,17.14 v34.16,14.61 | 30.05,4.9 v30.05,5.58

### Text on the board
bNames: Girlfriend Tracker V0.1